# EAGLE schematic co2-meter (EAGLE 7.5.0)
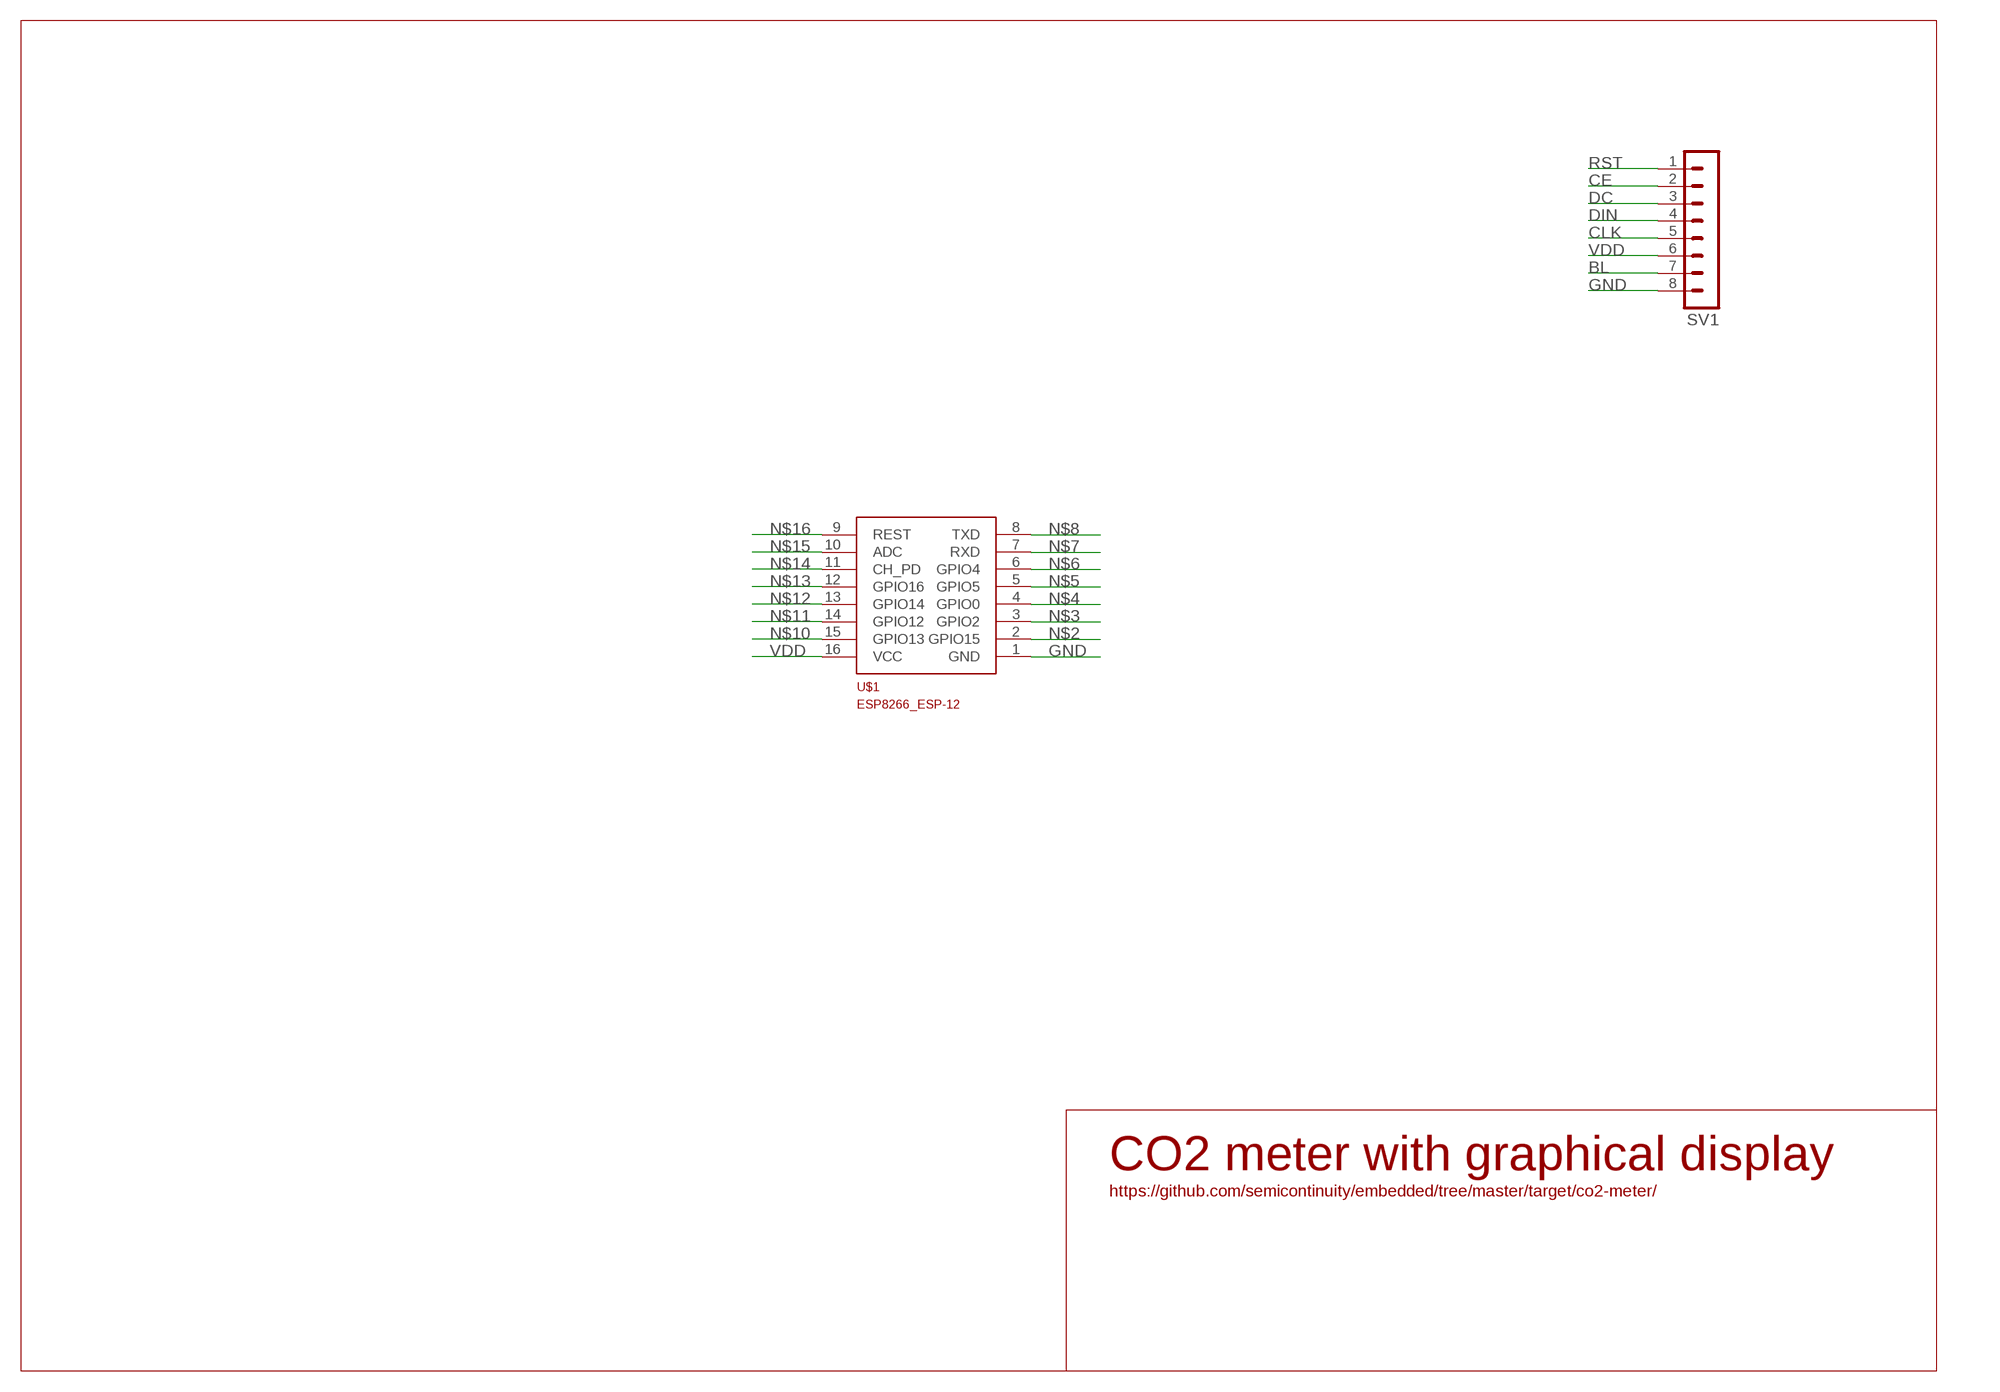
[diagram p0: schematic, sheet 1]

## Parts
SV1  MA08-1  [MA08-1]
U$1  ESP8266_ESP-12  [ESP8266-ESP12]

## Nets
BL: SV1.7
CE: SV1.2
CLK: SV1.5
DC: SV1.3
DIN: SV1.4
GND: SV1.8 U$1.1(GND)
N$2: U$1.2(GPIO15)
N$3: U$1.3(GPIO2)
N$4: U$1.4(GPIO0)
N$5: U$1.5(GPIO5)
N$6: U$1.6(GPIO4)
N$7: U$1.7(RXD)
N$8: U$1.8(TXD)
N$10: U$1.15(GPIO13)
N$11: U$1.14(GPIO12)
N$12: U$1.13(GPIO14)
N$13: U$1.12(GPIO16)
N$14: U$1.11(CH_PD)
N$15: U$1.10(ADC)
N$16: U$1.9(REST)
RST: SV1.1
VDD: SV1.6 U$1.16(VCC)

## Notes on the sheet
- CO2 meter with graphical display
- https://github.com/semicontinuity/embedded/tree/master/target/co2-meter/

## Library data of the parts
SV1 = con-lstb:MA08-1: PIN HEADER; OC_FARNELL: unknown; OC_NEWARK: unknown
U$1 = esp12:ESP8266_ESP-12